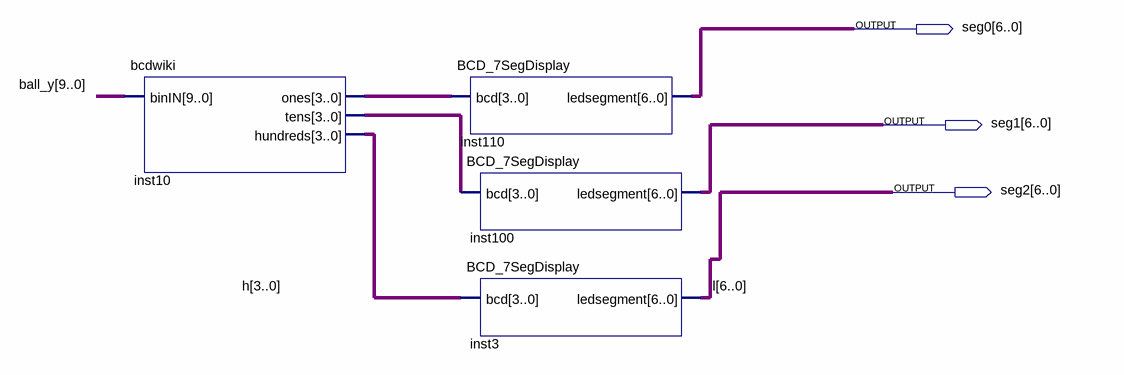
[diagram p0: schematic sheet]
// Quartus schematic Ypos.bdf as structural Verilog: 4 symbols, 3 pins
module Ypos (
  output [6:0] seg0,
  output [6:0] seg1,
  output [6:0] seg2
);

  wire [3:0] h, inst10_ones, inst10_tens;
  wire [9:0] ball_y;

  bcdwiki inst10 (.binIN(ball_y), .ones(inst10_ones), .tens(inst10_tens), .hundreds(h));
  BCD_7SegDisplay inst110 (.bcd(inst10_ones), .ledsegment(seg0));
  BCD_7SegDisplay inst100 (.bcd(inst10_tens), .ledsegment(seg1));
  BCD_7SegDisplay inst3 (.bcd(h), .ledsegment(seg2));

  // Other names for the same wires on the sheet: l[6:0] = seg2
endmodule
